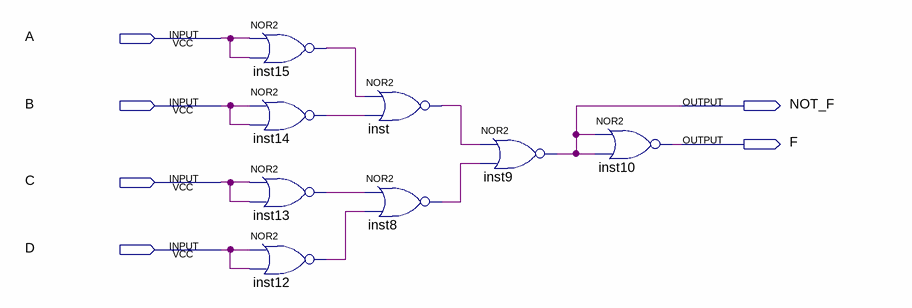
[diagram p0: schematic sheet]
// Quartus schematic Question3p2.bdf as structural Verilog: 8 symbols, 6 pins
module Question3p2 (
  input  A,
  input  B,
  input  C,
  input  D,
  output NOT_F,
  output F
);

  wire inst8_out, inst12_out, inst13_out, inst14_out, inst15_out, inst_out;

  nor inst15 (inst15_out, A, A);
  nor inst14 (inst14_out, B, B);
  nor inst13 (inst13_out, C, C);
  nor inst12 (inst12_out, D, D);
  nor inst (inst_out, inst15_out, inst14_out);
  nor inst8 (inst8_out, inst13_out, inst12_out);
  nor inst9 (NOT_F, inst_out, inst8_out);
  nor inst10 (F, NOT_F, NOT_F);
endmodule
